# EAGLE schematic IR Interface Board (EAGLE 7.7.0)

## Sheet 1 of 3
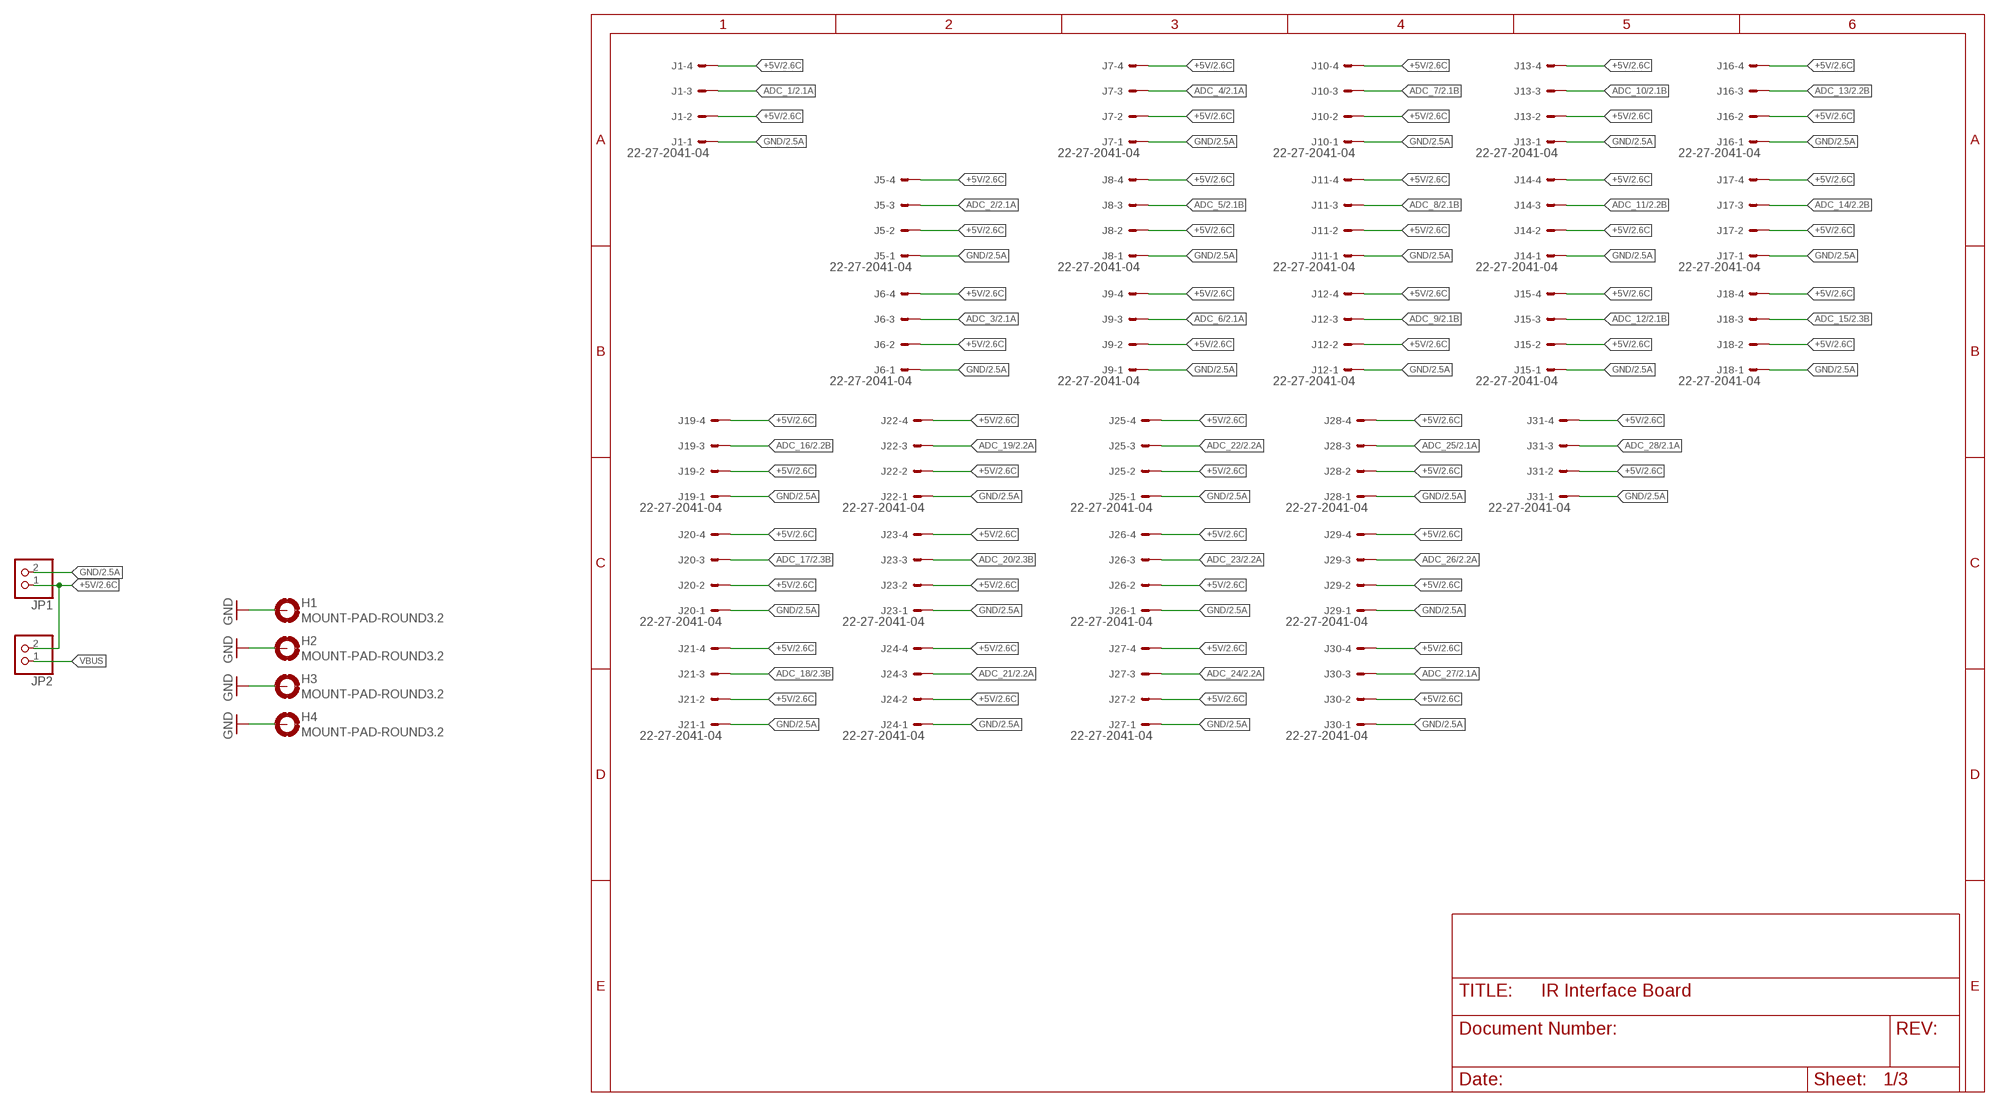
[diagram p0: schematic, sheet 1]

### Parts
H1  MOUNT-PAD-ROUND3.2  [3,2-PAD]
H2  MOUNT-PAD-ROUND3.2  [3,2-PAD]
H3  MOUNT-PAD-ROUND3.2  [3,2-PAD]
H4  MOUNT-PAD-ROUND3.2  [3,2-PAD]
J1  22-27-2041-04  [6410-04]
J5  22-27-2041-04  [6410-04]
J6  22-27-2041-04  [6410-04]
J7  22-27-2041-04  [6410-04]
J8  22-27-2041-04  [6410-04]
J9  22-27-2041-04  [6410-04]
J10  22-27-2041-04  [6410-04]
J11  22-27-2041-04  [6410-04]
J12  22-27-2041-04  [6410-04]
J13  22-27-2041-04  [6410-04]
J14  22-27-2041-04  [6410-04]
J15  22-27-2041-04  [6410-04]
J16  22-27-2041-04  [6410-04]
J17  22-27-2041-04  [6410-04]
J18  22-27-2041-04  [6410-04]
J19  22-27-2041-04  [6410-04]
J20  22-27-2041-04  [6410-04]
J21  22-27-2041-04  [6410-04]
J22  22-27-2041-04  [6410-04]
J23  22-27-2041-04  [6410-04]
J24  22-27-2041-04  [6410-04]
J25  22-27-2041-04  [6410-04]
J26  22-27-2041-04  [6410-04]
J27  22-27-2041-04  [6410-04]
J28  22-27-2041-04  [6410-04]
J29  22-27-2041-04  [6410-04]
J30  22-27-2041-04  [6410-04]
J31  22-27-2041-04  [6410-04]
JP1  PINHD-1X2  [1X02]
JP2  PINHD-1X2  [1X02]

### Nets
+5V: J1.2 J1.4 J5.2 J5.4 J6.2 J6.4 J7.2 J7.4 J8.2 J8.4 J9.2 J9.4 J10.2 J10.4 J11.2 J11.4 J12.2 J12.4 J13.2 J13.4 J14.2 J14.4 J15.2 J15.4 J16.2 J16.4 J17.2 J17.4 J18.2 J18.4 J19.2 J19.4 J20.2 J20.4 J21.2 J21.4 J22.2 J22.4 J23.2 J23.4 J24.2 J24.4 J25.2 J25.4 J26.2 J26.4 J27.2 J27.4 J28.2 J28.4 J29.2 J29.4 J30.2 J30.4 J31.2 J31.4 JP1.1 JP2.2 ; also sheet 2
ADC_1: J1.3 ; also sheet 2
ADC_2: J5.3 ; also sheet 2
ADC_3: J6.3 ; also sheet 2
ADC_4: J7.3 ; also sheet 2
ADC_5: J8.3 ; also sheet 2
ADC_6: J9.3 ; also sheet 2
ADC_7: J10.3 ; also sheet 2
ADC_8: J11.3 ; also sheet 2
ADC_9: J12.3 ; also sheet 2
ADC_10: J13.3 ; also sheet 2
ADC_11: J14.3 ; also sheet 2
ADC_12: J15.3 ; also sheet 2
ADC_13: J16.3 ; also sheet 2
ADC_14: J17.3 ; also sheet 2
ADC_15: J18.3 ; also sheet 2
ADC_16: J19.3 ; also sheet 2
ADC_17: J20.3 ; also sheet 2
ADC_18: J21.3 ; also sheet 2
ADC_19: J22.3 ; also sheet 2
ADC_20: J23.3 ; also sheet 2
ADC_21: J24.3 ; also sheet 2
ADC_22: J25.3 ; also sheet 2
ADC_23: J26.3 ; also sheet 2
ADC_24: J27.3 ; also sheet 2
ADC_25: J28.3 ; also sheet 2
ADC_26: J29.3 ; also sheet 2
ADC_27: J30.3 ; also sheet 2
ADC_28: J31.3 ; also sheet 2
GND: H1.B3,2(MOUNT) H2.B3,2(MOUNT) H3.B3,2(MOUNT) H4.B3,2(MOUNT) J1.1 J5.1 J6.1 J7.1 J8.1 J9.1 J10.1 J11.1 J12.1 J13.1 J14.1 J15.1 J16.1 J17.1 J18.1 J19.1 J20.1 J21.1 J22.1 J23.1 J24.1 J25.1 J26.1 J27.1 J28.1 J29.1 J30.1 J31.1 JP1.2 ; also sheet 2
VBUS: JP2.1 ; also sheet 2

## Sheet 2 of 3
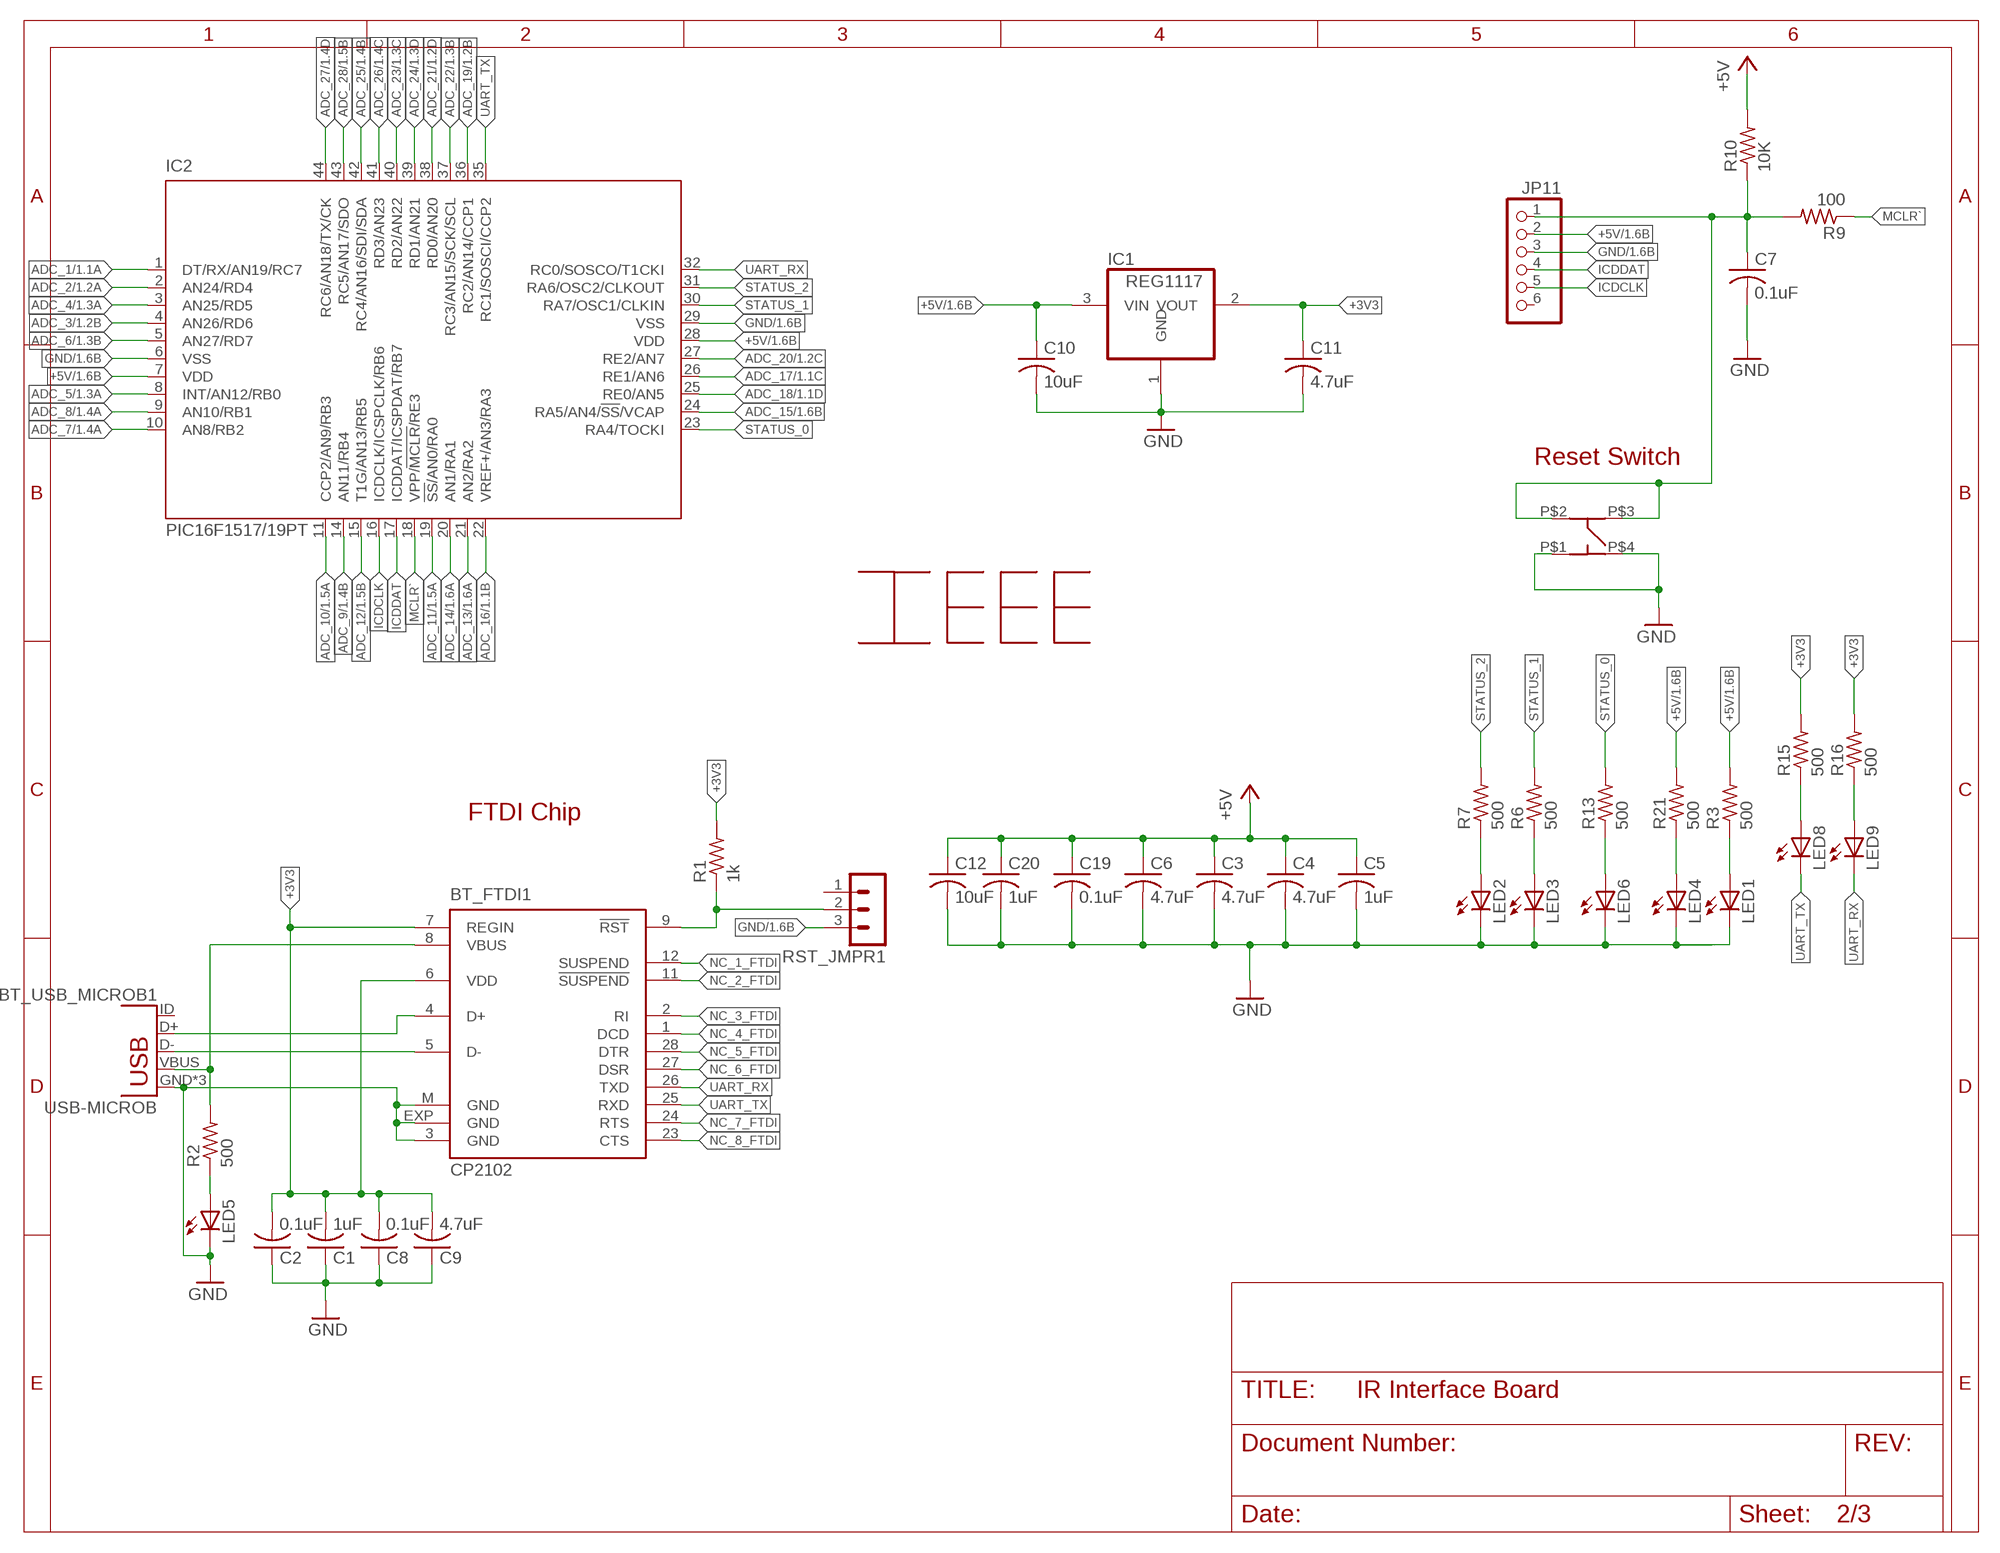
[diagram p1: schematic, sheet 2]

### Parts
BT_FTDI1  CP2102  [MLP28]
BT_USB_MICROB1  USB-MICROB  [USB-MICROB]
C1  1uF  C-USC0805  [C0805]
C2  0.1uF  C-USC0805  [C0805]
C3  4.7uF  C-USC0805  [C0805]
C4  4.7uF  C-USC0805  [C0805]
C5  1uF  C-USC0805  [C0805]
C6  4.7uF  C-USC0805  [C0805]
C7  0.1uF  C-USC0805  [C0805]
C8  0.1uF  C-USC0805  [C0805]
C9  4.7uF  C-USC0805  [C0805]
C10  10uF  C-USC0805  [C0805]
C11  4.7uF  C-USC0805  [C0805]
C12  10uF  C-USC0805  [C0805]
C19  0.1uF  C-USC0805  [C0805]
C20  1uF  C-USC0805  [C0805]
IC1  REG1117  [SOT223]
IC2  PIC16F1517/19PT  [TQFP44]
JP11  PINHD-1X6/90  [1X06/90]
LED1  LEDSML0603  [SML0603]
LED2  LEDSML0603  [SML0603]
LED3  LEDSML0603  [SML0603]
LED4  LEDSML0603  [SML0603]
LED5  LEDSML0603  [SML0603]
LED6  LEDSML0603  [SML0603]
LED8  LEDSML0603  [SML0603]
LED9  LEDSML0603  [SML0603]
R1  1k  R-US_R0805  [R0805]
R2  500  R-US_R0805  [R0805]
R3  500  R-US_R0805  [R0805]
R6  500  R-US_R0805  [R0805]
R7  500  R-US_R0805  [R0805]
R9  100  R-US_R0805  [R0805]
R10  10K  R-US_R0805  [R0805]
R13  500  R-US_R0805  [R0805]
R15  500  R-US_R0805  [R0805]
R16  500  R-US_R0805  [R0805]
R21  500  R-US_R0805  [R0805]
RST_JMPR1  MA03-1  [MA03-1]
TOUCH_RESET  RESET  MC32882_SW  [MC32882_FINAL]
U$1  LOGO  [IEEE-LOGO]

### Nets
+3V3: BT_FTDI1.6(VDD) BT_FTDI1.7(REGIN) C1.2 C2.2 C8.2 C9.2 C11.1 IC1.2(VOUT) R1.2 R15.2 R16.2
+5V: C3.1 C4.1 C5.1 C6.1 C10.1 C12.1 C19.1 C20.1 IC1.3(VIN) IC2.7(VDD) IC2.28(VDD) JP11.2 R3.2 R10.2 R21.2 ; also sheet 1
ADC_1: IC2.1(DT/RX/AN19/RC7) ; also sheet 1
ADC_2: IC2.2(AN24/RD4) ; also sheet 1
ADC_3: IC2.4(AN26/RD6) ; also sheet 1
ADC_4: IC2.3(AN25/RD5) ; also sheet 1
ADC_5: IC2.8(INT/AN12/RB0) ; also sheet 1
ADC_6: IC2.5(AN27/RD7) ; also sheet 1
ADC_7: IC2.10(AN8/RB2) ; also sheet 1
ADC_8: IC2.9(AN10/RB1) ; also sheet 1
ADC_9: IC2.14(AN11/RB4) ; also sheet 1
ADC_10: IC2.11(CCP2/AN9/RB3) ; also sheet 1
ADC_11: IC2.19(!SS!/AN0/RA0) ; also sheet 1
ADC_12: IC2.15(T1G/AN13/RB5) ; also sheet 1
ADC_13: IC2.21(AN2/RA2) ; also sheet 1
ADC_14: IC2.20(AN1/RA1) ; also sheet 1
ADC_15: IC2.24(RA5/AN4/!SS!/VCAP) ; also sheet 1
ADC_16: IC2.22(VREF+/AN3/RA3) ; also sheet 1
ADC_17: IC2.26(RE1/AN6) ; also sheet 1
ADC_18: IC2.25(RE0/AN5) ; also sheet 1
ADC_19: IC2.36(RC2/AN14/CCP1) ; also sheet 1
ADC_20: IC2.27(RE2/AN7) ; also sheet 1
ADC_21: IC2.38(RD0/AN20) ; also sheet 1
ADC_22: IC2.37(RC3/AN15/SCK/SCL) ; also sheet 1
ADC_23: IC2.40(RD2/AN22) ; also sheet 1
ADC_24: IC2.39(RD1/AN21) ; also sheet 1
ADC_25: IC2.42(RC4/AN16/SDI/SDA) ; also sheet 1
ADC_26: IC2.41(RD3/AN23) ; also sheet 1
ADC_27: IC2.44(RC6/AN18/TX/CK) ; also sheet 1
ADC_28: IC2.43(RC5/AN17/SDO) ; also sheet 1
BT_D+1: BT_FTDI1.4(D+) BT_USB_MICROB1.D+
BT_D-1: BT_FTDI1.5(D-) BT_USB_MICROB1.D-
GND: BT_FTDI1.3(GND) BT_FTDI1.EXP(GND) BT_FTDI1.M(GND) BT_USB_MICROB1.GND BT_USB_MICROB1.MT1(GND) BT_USB_MICROB1.MT2(GND) C1.1 C2.1 C3.2 C4.2 C5.2 C6.2 C7.2 C8.1 C9.1 C10.2 C11.2 C12.2 C19.2 C20.2 IC1.1(GND) IC2.6(VSS) IC2.29(VSS) JP11.3 LED1.C LED2.C LED3.C LED4.C LED5.C LED6.C RST_JMPR1.3 TOUCH_RESET.P$1(P1) TOUCH_RESET.P$4(P4) ; also sheet 1
ICDCLK: IC2.16(ICDCLK/ICSPCLK/RB6) JP11.5
ICDDAT: IC2.17(ICDDAT/ICSPDAT/RB7) JP11.4
MCLR: C7.1 JP11.1 R9.2 R10.1 TOUCH_RESET.P$2(P2) TOUCH_RESET.P$3(P3)
MCLR`: IC2.18(VPP/!MCLR!/RE3) R9.1
N$1: LED3.A R6.1
N$2: BT_FTDI1.9(!RST) R1.1 RST_JMPR1.2
N$3: LED6.A R13.1
N$4: LED1.A R3.1
N$6: LED2.A R7.1
N$8: LED4.A R21.1
N$10: LED8.A R15.1
N$11: LED9.A R16.1
N$12: LED5.A R2.1
NC_1_FTDI: BT_FTDI1.12(SUSPEND)
NC_2_FTDI: BT_FTDI1.11(!SUSPEND)
NC_3_FTDI: BT_FTDI1.2(RI)
NC_4_FTDI: BT_FTDI1.1(DCD)
NC_5_FTDI: BT_FTDI1.28(DTR)
NC_6_FTDI: BT_FTDI1.27(DSR)
NC_7_FTDI: BT_FTDI1.24(RTS)
NC_8_FTDI: BT_FTDI1.23(CTS)
STATUS_0: IC2.23(RA4/TOCKI) R13.2
STATUS_1: IC2.30(RA7/OSC1/CLKIN) R6.2
STATUS_2: IC2.31(RA6/OSC2/CLKOUT) R7.2
UART_RX: BT_FTDI1.26(TXD) IC2.32(RC0/SOSCO/T1CKI) LED9.C
UART_TX: BT_FTDI1.25(RXD) IC2.35(RC1/SOSCI/CCP2) LED8.C
VBUS: BT_FTDI1.8(VBUS) BT_USB_MICROB1.VBUS R2.2 ; also sheet 1
Unconnected: BT_USB_MICROB1.ID JP11.6 RST_JMPR1.1

### Notes on the sheet
- Reset Switch
- FTDI Chip

## Sheet 3 of 3
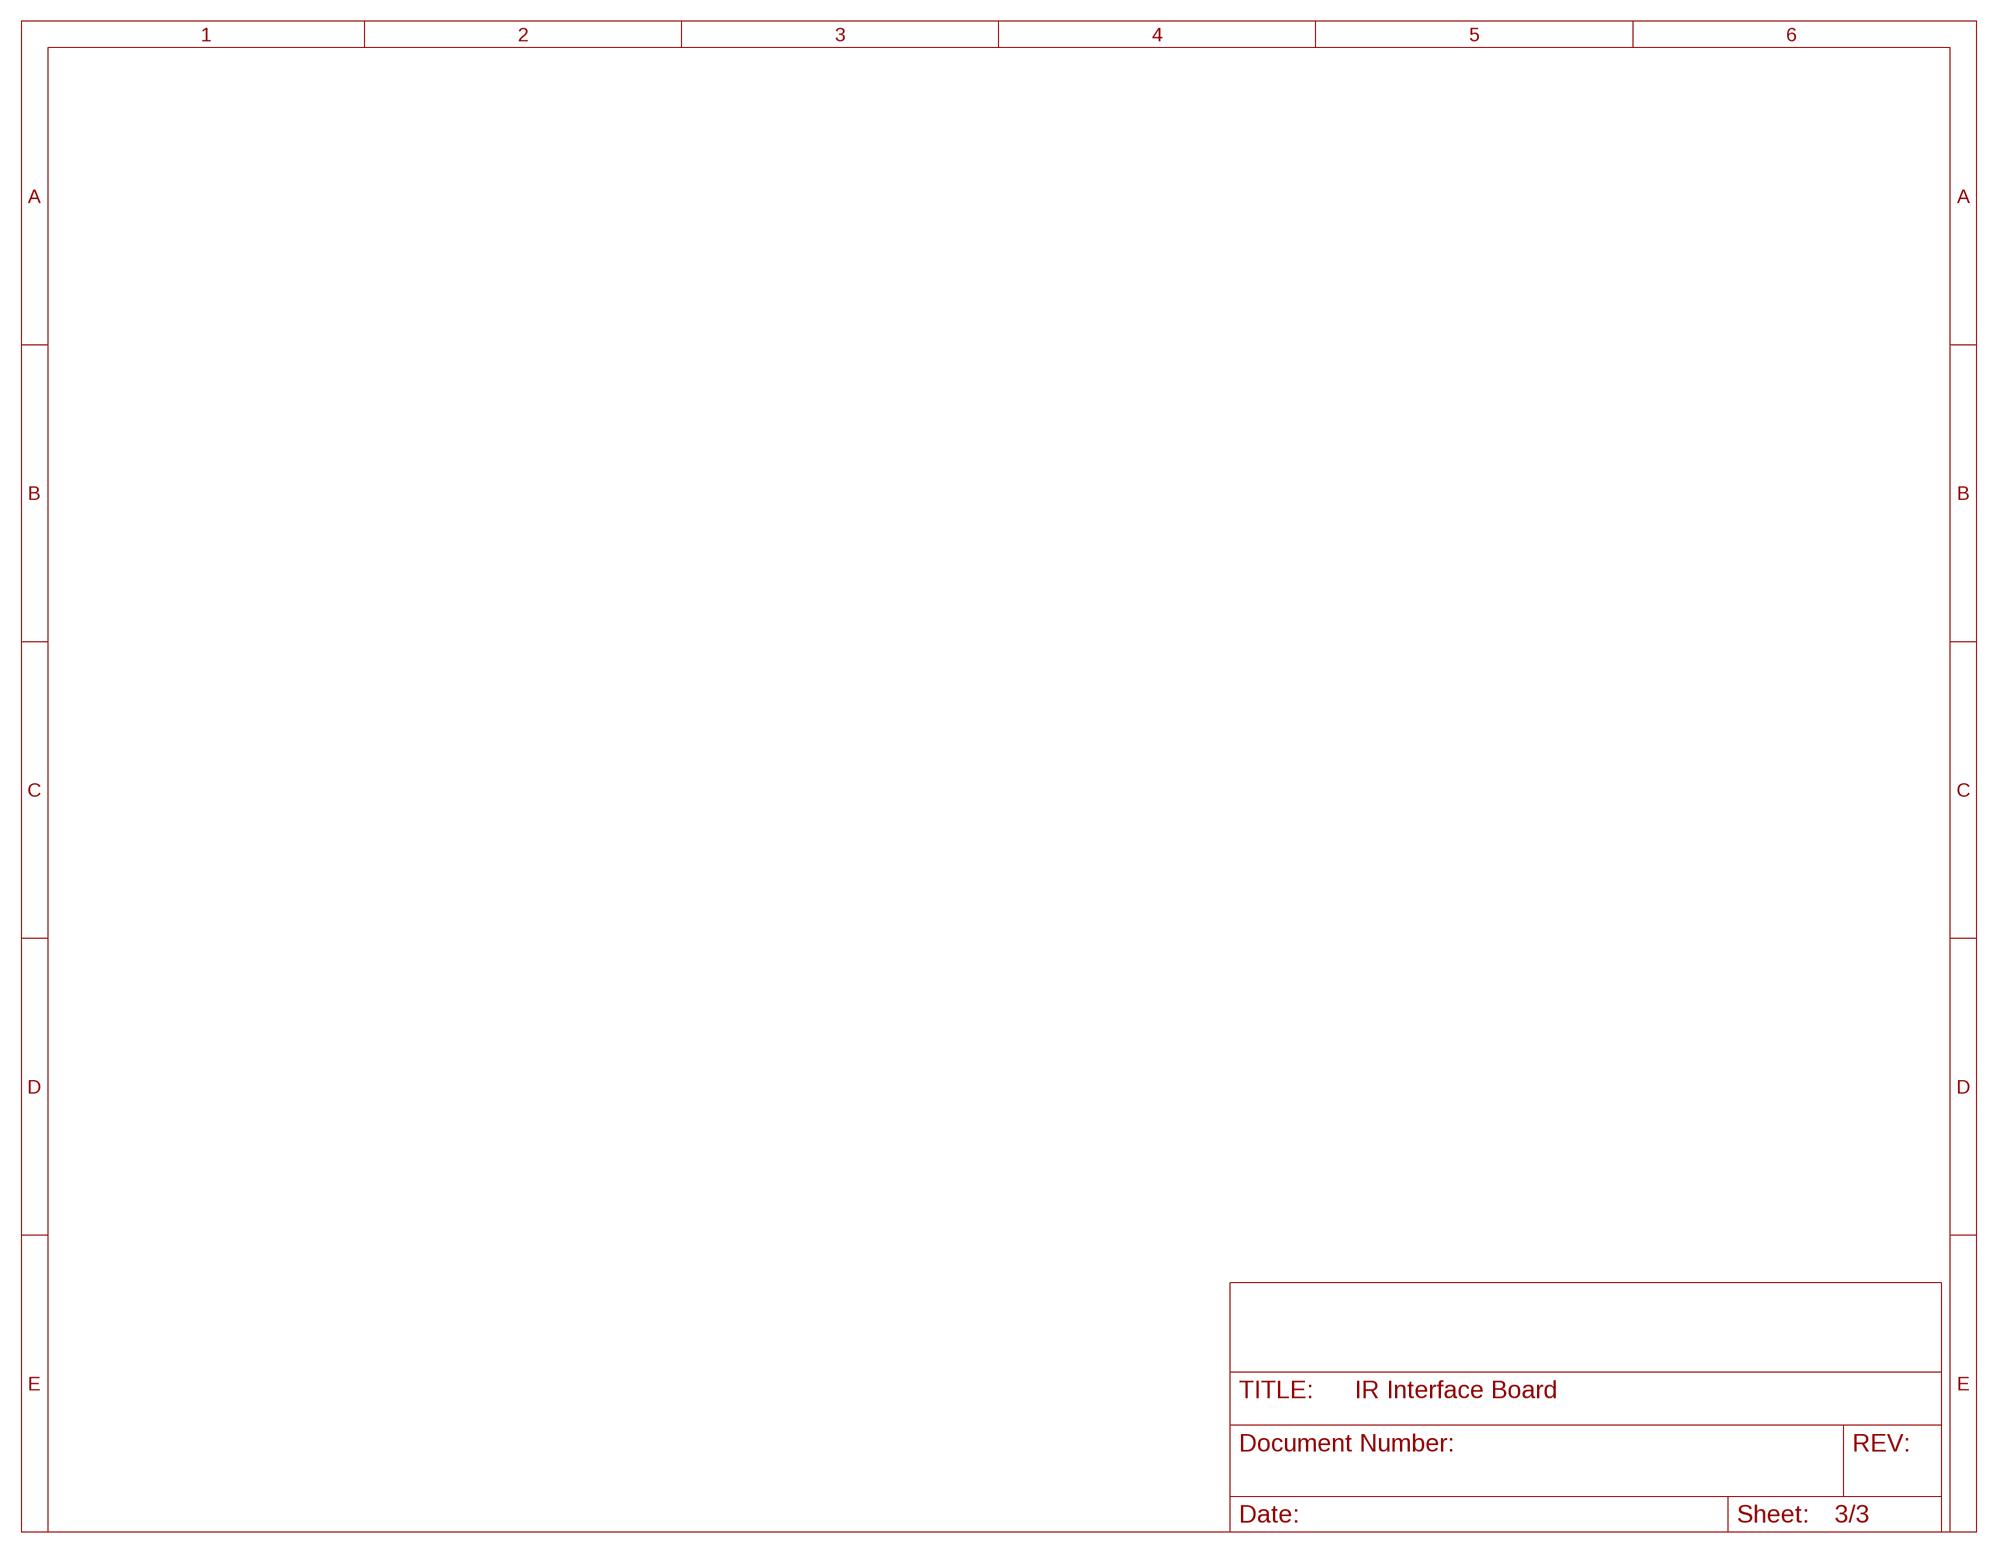
[diagram p2: schematic, sheet 3]

## Library data of the parts
BT_FTDI1 = silabs:CP210*: Single-Chip USB to UART Bridge Source: www.silabs.com .. CP2101.pdf / cp2102.pdf; MF: FARNELL; MPN: CP2102-GM; OC_FARNELL: 9282130; OC_NEWARK: 30K5635
BT_USB_MICROB1 = Mother-Board-rev5:USB: USB Connectors USB-B-PTH is fully proven SKU : PRT-00139/CONN-08278 USB-miniB is fully proven SKU : PRT-00587 USB-A-PCB is untested. USB-A-H is throughly reviewed, but untested. Spark Fun Electronics SKU : PRT-00437 USB-B-SMT is throughly reviewed, but untested. Needs silkscreen touching up. USB-A-S has not been used/tested USB-MB-H has not been used/tested USB-MICROB has been used. CONN-09505; PROD_ID: CONN-09505
C1-C12 C19 C20 = rcl:C-US: CAPACITOR, American symbol
H1-H4 = holes:MOUNT-PAD-ROUND: MOUNTING PAD, round
IC1 = burr-brown:REG1117: 800mA and 1A Low Dropout (LDO) Positive Regulator 1.8V, 2.5V, 2.85V, 3.3V, 5V, and Adj; MPN: REG1117; OC_FARNELL: 1097566; OC_NEWARK: 14P6981
IC2 = microchip:PIC16*F1517/19: 28/40/44-Pin Flash Microcontrollers with nanoWatt XLP Technology PIC16F1517/1519 AND PIC16LF1517/1519 Source: www.microchip.com PIC16F1516.pdf
J1 J5-J31 = con-molex:22-?-04: CONNECTOR wire to board 2.54 mm (.1 inch) pitch header; OC_FARNELL: unknown; OC_NEWARK: unknown
JP1 JP2 = pinhead:PINHD-1X2: PIN HEADER
JP11 = pinhead:PINHD-1X6: PIN HEADER
LED1-LED6 LED8 LED9 = interface_board-rev13:LED: LED OSRAM: - CHIPLED LG R971, LG N971, LY N971, LG Q971, LY Q971, LO R971, LY R971 LH N974, LH R974 LS Q976, LO Q976, LY Q976 LO Q996 - Hyper CHIPLED LW Q18S LB Q993, LB Q99A, LB R99A - SideLED LS A670, LO A670, LY A670, LG A670, LP A670 LB A673, LV A673, LT A673, LW A673 LH A674 LY A675 LS A676, LA A676, LO A676, LY A676, LW A676 LS A679, LY A679, LG A679 - Hyper Micro SIDELED® LS Y876, LA Y876, LO Y876, LY Y876 LT Y87S - SmartLED LW L88C, LW L88S LB L89C, LB L89S, LG L890 LS L89K, LO L89K, LY L89K LS L896, LA L896, LO L896, LY L896 - TOPLED LS T670, LO T670, LY T670, LG T670, LP T670 LSG T670, LSP T670, LSY T670, LOP T670, LYG T670 LG T671, LOG T671, LSG T671 LB T673, LV T673, LT T673, LW T673 LH T674 LS T676, LA T676, LO T676, LY T676, LB T676, LH T676, LSB T676, LW T676 LB T67C, LV T67C, LT T67C, LS T67K, LO T67K, LY T67K, LW E67C LS E67B, LA E67B, LO E67B, LY E67B, LB E67C, LV E67C, LT E67C LW T67C LS T679, LY T679, LG T679 LS T770, LO T770, LY T770, LG T770, LP T770 LB T773, LV T773, LT T773, LW T773 LH T774 LS E675, LA E675, LY E675, LS T675 LS T776, LA T776, LO T776, LY T776, LB T776 LHGB T686 LT T68C, LB T68C - Hyper Mini TOPLED® LB M676 - Mini TOPLED Santana® LG M470 LS M47K, LO M47K, LY M47K Source: http://www.osram.convergy.de LUXEON: - LUMILED® LXK2-PW12-R00, LXK2-PW12-S00, LXK2-PW14-U00, LXK2-PW14-V00 LXK2-PM12-R00, LXK2-PM12-S00, LXK2-PM14-U00 LXK2-PE12-Q00, LXK2-PE12-R00, LXK2-PE12-S00, LXK2-PE14-T00, LXK2-PE14-U00 LXK2-PB12-K00, LXK2-PB12-L00, LXK2-PB12-M00, LXK2-PB14-N00, LXK2-PB14-P00, LXK2-PB14-Q00 LXK2-PR12-L00, LXK2-PR12-M00, LXK2-PR14-Q00, LXK2-PR14-R00 LXK2-PD12-Q00, LXK2-PD12-R00, LXK2-PD12-S00 LXK2-PH12-R00, LXK2-PH12-S00 LXK2-PL12-P00, LXK2-PL12-Q00, LXK2-PL12-R00 Source: www.luxeon.com KINGBRIGHT: KA-3528ASYC Source: www.kingbright.com
R1 = resistor:R-US_: RESISTOR, American symbol
R2 R3 R6 R7 R9 R10 R13 R15 R16 R21 = rcl:R-US_: RESISTOR, American symbol
RST_JMPR1 = con-lstb:MA03-1: PIN HEADER; OC_FARNELL: unknown; OC_NEWARK: unknown
TOUCH_RESET = power_lib:MC32882_SW
U$1 = IEEE-logo:LOGO